# Altium schematic sheet st_link.SchDoc: ST-Link
size A3; DrawnBy: Angus Macdonald; SheetNumber: 5; SheetTotal: 5
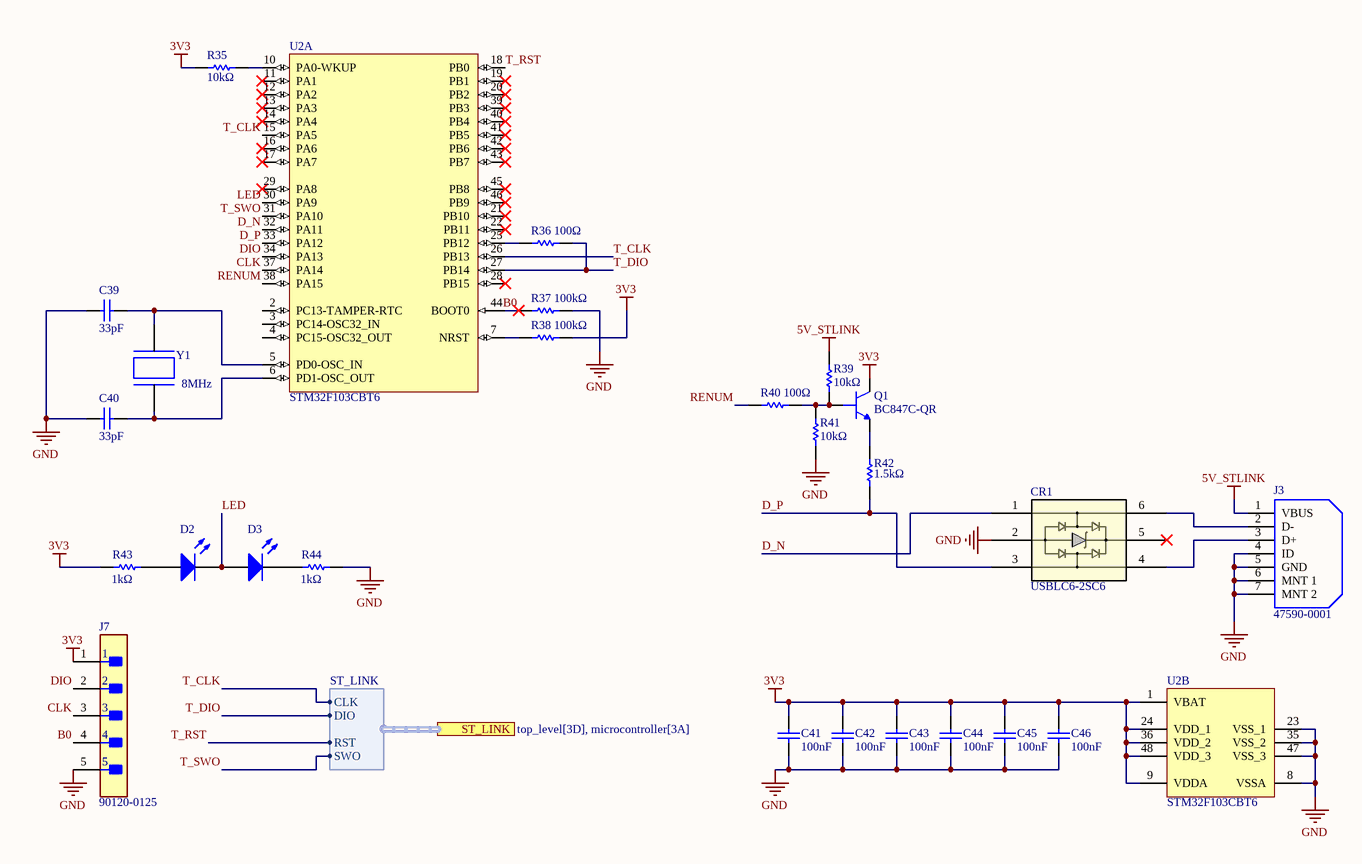
[diagram p0: st_link.SchDoc]

## Parts
C39  value 33pF  [C0603]  (hidden comment: CC0603JPNPO9BN330)
C40  value 33pF  [C0603]  (hidden comment: CC0603JPNPO9BN330)
C41  value 100nF  [C0603]  (hidden comment: CC0603KRX7R8BB104)
C42  value 100nF  [C0603]  (hidden comment: CC0603KRX7R8BB104)
C43  value 100nF  [C0603]  (hidden comment: CC0603KRX7R8BB104)
C44  value 100nF  [C0603]  (hidden comment: CC0603KRX7R8BB104)
C45  value 100nF  [C0603]  (hidden comment: CC0603KRX7R8BB104)
C46  value 100nF  [C0603]  (hidden comment: CC0603KRX7R8BB104)
CR1  USBLC6-2SC6  [SOT23-6L_STM]
D2  LED EMERALD 0805  [0805 LED]  (value not drawn)
D3  LED RED 0805  [0805 LED]  (value not drawn)
J3  47590-0001  [USB]
J7  90120-0125  [FP-90120-0125-MFG]
Q1  BC847C-QR  [TO-236AB-3]
R35  value 10kΩ  [RESC1608X55X25ML10T15]  (hidden comment: RC0603FR-0710KL)
R36  value 100Ω  [RESC1608X55X25ML10T15]  (hidden comment: RC0603FR-07100RL)
R37  value 100kΩ  [RESC1608X55X25ML10T15]  (hidden comment: RC0603FR-07100KL)
R38  value 100kΩ  [RESC1608X55X25ML10T15]  (hidden comment: RC0603FR-07100KL)
R39  value 10kΩ  [RESC1608X55X25ML10T15]  (hidden comment: RC0603FR-0710KL)
R40  value 100Ω  [RESC1608X55X25ML10T15]  (hidden comment: RC0603FR-07100RL)
R41  value 10kΩ  [RESC1608X55X25ML10T15]  (hidden comment: RC0603FR-0710KL)
R42  value 1.5kΩ  [RESC1608X55X25ML10T15]  (hidden comment: RC0603JR-071K5L)
R43  value 1kΩ  [RESC1608X55X25ML10T15]  (hidden comment: RC0603FR-101KL)
R44  value 1kΩ  [RESC1608X55X25ML10T15]  (hidden comment: RC0603FR-101KL)
U2  STM32F103CBT6  [STM-LQFP48_N]  (parts A,B of 2)
Y1  Frequency: 8MHz  [RESC5032X135N]  (hidden comment: X50328MSB2GI)

## Ports
ST_LINK (harness ST_LINK, see top_level[3D], microcontroller[3A])

## Harnesses
ST_LINK: CLK, DIO, RST, SWO

## Nets
3V3: C41.2 C42.2 C43.2 C44.2 C45.2 C46.2 J7.1 Q1.3(Collector) R35.2 R38.2 R43.1 U2.1(VBAT) U2.9(VDDA) U2.24(VDD_1) U2.36(VDD_2) U2.48(VDD_3)
5V_STLINK: J3.1(VBUS) R39.1
GND: C39.1 C40.2 C41.1 C42.1 C43.1 C44.1 C45.1 C46.1 CR1.2 J3.4(ID) J3.5(GND) J3.6(MNT_1) J3.7(MNT_2) J7.5 R37.2 R41.2 R44.2 U2.8(VSSA) U2.23(VSS_1) U2.35(VSS_2) U2.47(VSS_3)
B0: J7.4 R37.1 U2.44(BOOT0)
CLK: J7.3 U2.37(PA14)
D_N: CR1.1 U2.32(PA11)
D_P: CR1.3 R42.1 U2.33(PA12)
DIO: J7.2 U2.34(PA13)
LED: D2.K D3.A U2.30(PA9)
RENUM: R40.1 U2.38(PA15)
T_CLK: U2.15(PA5) U2.26(PB13) ; port ST_LINK.CLK
T_DIO: R36.2 U2.27(PB14) ; port ST_LINK.DIO
T_RST: U2.18(PB0) ; port ST_LINK.RST
T_SWO: U2.31(PA10) ; port ST_LINK.SWO
NetC39_2: C39.2 U2.5(PD0-OSC_IN) Y1.2
NetC40_1: C40.1 U2.6(PD1-OSC_OUT) Y1.1
NetCR1_4: CR1.4 J3.3(D+)
NetCR1_6: CR1.6 J3.2(D-)
NetD2_A: D2.A R43.2
NetD3_K: D3.K R44.1
NetQ1_1: Q1.1(Base) R39.2 R40.2 R41.1
NetQ1_2: Q1.2(Emitter) R42.2
NetR35_1: R35.1 U2.10(PA0-WKUP)
NetR36_1: R36.1 U2.25(PB12)
NetR38_1: R38.1 U2.7(NRST)

Not connected (* = marked no-connect by the designer): CR1 5*; U2 2(PC13-TAMPER-RTC) 3(PC14-OSC32_IN) 4(PC15-OSC32_OUT) 11(PA1)* 12(PA2)* 13(PA3)* 14(PA4)* 16(PA6)* 17(PA7)* 19(PB1)* 20(PB2)* 21(PB10)* 22(PB11)* 28(PB15)* 29(PA8)* 39(PB3)* 40(PB4)* 41(PB5)* 42(PB6)* 43(PB7)* 45(PB8)* 46(PB9)*

## Library data of the parts
C39 C40 = CMP-00295-1: 0603 33 pF 50 V ±5 % Tolerance C0G/NP0 SMT Multilayer Ceramic Capacitor; Tolerance: 5%; Voltage Rating (DC): 50V; Dielectric: C0G; Halogen Free: Halogen Free; Depth: 800µm; Export Control Classification Number (ECCN) Code: EAR99; Case/Package: 0603; RoHS: Compliant; Harmonized Tariff Schedule (HTS) Code: 8532.24.00.20; Lifecycle Status: Production; Dielectric Material: Ceramic; Number of Terminals: 2; Width: 800µm; Length: 1.6mm; Mounting Technology: Surface Mount; Composition: Ceramic; Lead Free: Lead Free; Max Operating Temperature: 125°C; Min Operating Temperature: -55°C; Country of Origin: Mainland China, Taiwan; REACH SVHC: Yes; Radiation Hardening: No; China RoHS: Compliant; Packaging: Tape and Reel; Height: 800µm; Introduction Date: 2003-08-13
C41-C46 = CMP-00179-1: 25V 100nF X7R ±10% 0603 Multilayer Ceramic Capacitors MLCC - SMD/SMT ROHS; Length: 1.6mm; Pins: 2; Case/Package: 0603; Composition: Ceramic; Lead Free: Lead Free; Lifecycle Status: Production; RoHS: Compliant; China RoHS: Compliant; Number of Terminals: 2; Max Operating Temperature: 125°C; Tolerance: 10%; Width: 800µm; Dielectric Material: Ceramic; Voltage Rating (DC): 25V; Depth: 800µm; Min Operating Temperature: -55°C; Halogen Free: Halogen Free; Mounting Technology: Surface Mount; Material: Ceramic; REACH SVHC: Yes; Case Code (Imperial): 0603; Height: 800µm; Schedule B: 8532240020, 8532240020; Voltage Rating: 25V; Thickness: 889µm; Termination: SMD/SMT; Dielectric: X7R; Radiation Hardening: No; Voltage: 25V; Case Code (Metric): 1608
CR1 = CMP-304-000000-1: ESD Protection for USB 2.0 High Speed; Manufacturer_Name: STMicroelectronics; Type: Type; Design Item ID: USBLC6-2SC6; RefDes: RefDes; Source: USBLC6-2SC6.SchLib; Manufacturer_Part_Number: USBLC6-2SC6; Copyright: Copyright (C) 2025 Ultra Librarian. All rights reserved.
D2 = CMP-002-000017-2: Emerald 0805  Light Emitting Diodes (LED) ROHS GREEN JLCPCB PICK&PLACE; MFR.Part #: C2297; Manufacturer: Hubei KENTO Elec; Color: Emerald; JLCPCB Part #: C2297
D3 = CMP-002-000018-2: Red 0805  Light Emitting Diodes (LED) ROHS JLCPCB PICK&PLACE; Manufacturer: Foshan NationStar Optoelectronics; MFR.Part #: C84256; JLCPCB Part #: C84256; Color: Red
J3 = CMP-014-000015-2: USB Connector Micro-AB SMD, 5 Contact(s), Female, Right Angle, Surface Mount Terminal, Locking, Receptacle, JLCPCB, PICK&PLACE; Manufacturer: MOLEX; MFR.Part #: 475900001; Source: https://jlcpcb.com/partdetail/Molex-475900001/C136001; JLCPCB Part #: C136001
J7 = CMP-014-000025-1: Board Connector, 5 Contact(s), 1 Row(s), Male, Straight, 0.1 inch Pitch, Solder Terminal, Black Insulator, Receptacle; Withdrawl Force-Min: 0.1946N; PCB Contact Pattern: RECTANGULAR; IEC Conformance: No; Reliability: COMMERCIAL; Mating Information: MULTIPLE MATING PARTS AVAILABLE; Number Of Connectors: 1; Insertion Force-Max: 3.0024N; Insulation Resistance: 5GR; Option: General Purpose; Contact Style: SQ PIN-SKT; Body Depth: 0.098inch; Plating Thickness: 160uin; Number of Contacts: 5; Contact Resistance: 20mR; Reference Standard: UL; Dielectric Withstanding Voltage (DC): 350V; Body Length: 0.5inch; Rated Current (Signal): 3A; Min Operating Temperature: -55°C; Mating Contact Pitch: 0.1inch; Body/Shell Style: RECEPTACLE; Flammability Rating: UL94 V-0; Mounting Style: STRAIGHT; Mixed Contacts: No; Contact Finish - Mating: NOT SPECIFIED; RoHS Compliant: Yes; Contact Material: Copper Alloy; MIL Conformance: No; Connector Type: BOARD CONNECTOR; JESD-609 Code: e4; Filter Feature: No; DIN Conformance: No; Terminal Length: 0.114inch; Body Breadth: 0.1inch; Contact Gender: Male; Insulation Color: Black; Mounting Technology: Board; Termination: Solder; Terminal Pitch: 2.54mm; Contact Finish - Termination: Gold (Au); Number Of PCB Rows: 1; Max Operating Temperature: 125°C; Contact Pattern: RECTANGULAR; Number of Rows Loaded: 1; Reach SVHC Compliant: Yes; Insulation Material: Glass
Q1 = CMP-001-0003-7: NPN general-purpose transistors in a small SOT23 (TO-236AB) Surface-Mounted Device (SMD); ComponentLink1URL: https://au.mouser.com/ProductDetail/Nexperia/BC847C-QR?qs=e8oIoAS2J1RqA3Lgar2wrA%3D%3D; ComponentLink1Description: Mouser; Manufacturer Part Number: BC847C-QR; JLCPCB Part #: C5336792
R35 R39 R41 = CMP-RES-00040-1: 10 kOhms ±1% 0.1W, 1/10W Chip Resistor 0603 (1608 Metric) Moisture Resistant Thick Film; Tolerance: 1%; Case/Package: 0603
R36 R40 = CMP-RES-00083-1: Yageo RC0603FR-07100RL 0603 SMD Resistor 100 Ohm thin film chip resistor; Temperature Coefficient: 100ppm/°C; Working Voltage: 75V; Power Dissipation: 100mW; Voltage Rating (DC): 50V; Tolerance: 1%; Lead Free: Lead Free; Lifecycle Status: Production; Packaging: Cut Tape (CT); Height: 450µm; Pins: 2; Contact Plating: Tin; Mounting Technology: Surface Mount; Length: 1.6mm; Termination: SMD/SMT; Max Operating Temperature: 155°C; Width: 800µm; Case Code (Metric): 0603; Power Rating: 100mW; Voltage Rating: 75V; RoHS: Compliant; Depth: 800µm; Military Standard: Not; Min Operating Temperature: -55°C; Composition: Thick Film; Radiation Hardening: No; Case/Package: 0603; REACH SVHC: Yes; Number of Terminals: 2; Case Code (Imperial): 0603; China RoHS: Non-Compliant; Schedule B: 8533210045, 8533210045
R37 R38 = CMP-RES-00026-1: Res General Purpose Thick Film 0603 100k Ohm 1% 1/10W ±100ppm/°C Molded Paper T/R; Working Voltage: 75V; Voltage Rating (DC): 50V; Power Dissipation: 100mW; Tolerance: 1%; Number of Terminations: 2; Pins: 2; China RoHS: Non-Compliant; Schedule B: 8533210045, 8533210045; Military Standard: Not; Max Operating Temperature: 155°C; Depth: 800µm; Height: 450µm; Voltage Rating: 75V; Case/Package: 0603; Length: 1.6mm; Packaging: Tape & Reel; RoHS: Compliant; Width: 800µm; Power Rating: 100mW; Number of Terminals: 2; Case Code (Imperial): 0603; Lead Free: Lead Free; Termination: SMD/SMT; Case Code (Metric): 0603; Mounting Technology: Surface Mount; Composition: Thick Film; Min Operating Temperature: -55°C; REACH SVHC: Yes; Temperature Coefficient: 100ppm/°C; Lifecycle Status: Production
R42 = CMP-RES-00084-1: Res General Purpose Thick Film 0603 1.5k Ohm 5% 1/10W ±100ppm/°C Molded Paper T/R; Voltage Rating (DC): 50V; Working Voltage: 75V; Power Rating: 100mW; Lifecycle Status: Production; Weight: 2.012816mg; China RoHS: Non-Compliant; Pins: 2; Lead Free: Lead Free; Composition: Thick Film; Length: 1.6mm; Max Operating Temperature: 155°C; Mounting Technology: Surface Mount; Features: Moisture Resistant; Temperature Coefficient: 100ppm/°C; Termination: SMD/SMT; Case Code (Imperial): 0603; Military Standard: Not; REACH SVHC: Yes; Voltage Rating (AC): 50V; Number of Terminations: 2; Packaging: Tape & Reel; Height: 450µm; Schedule B: 8533210045, 8533210045; Depth: 800µm; Tolerance: 5%; Radiation Hardening: No; Power Dissipation: 100mW; Number of Terminals: 2; Max Power Dissipation: 100mW; Min Operating Temperature: -55°C; RoHS: Compliant; Voltage Rating: 75V; Case/Package: 0603; Contact Plating: Tin; Width: 800µm
R43 R44 = CMP-RES-00029-1: 1 kOhms ±1% 0.1W, 1/10W Chip Resistor 0603 (1608 Metric) Moisture Resistant Thick Film; Case/Package: 0603; Tolerance: 1%
U2 = CMP-015-000003-2: RISC Microcontroller, 32-Bit, FLASH, CORTEX-M3 CPU, 72MHz, CMOS, PQFP48; JLCPCB Part #: C8304
Y1 = CMP-002-000019-2: 8MHz 20pF ±10ppm SMD5032-2P Crystals ROHS JLCPCB PICK&PLACE; Manufacturer: Yangxing Tech; JLCPCB Part #: C115962; MFR.Part #: X50328MSB2GI